# EAGLE design nvs_gps (EAGLE 6.4)
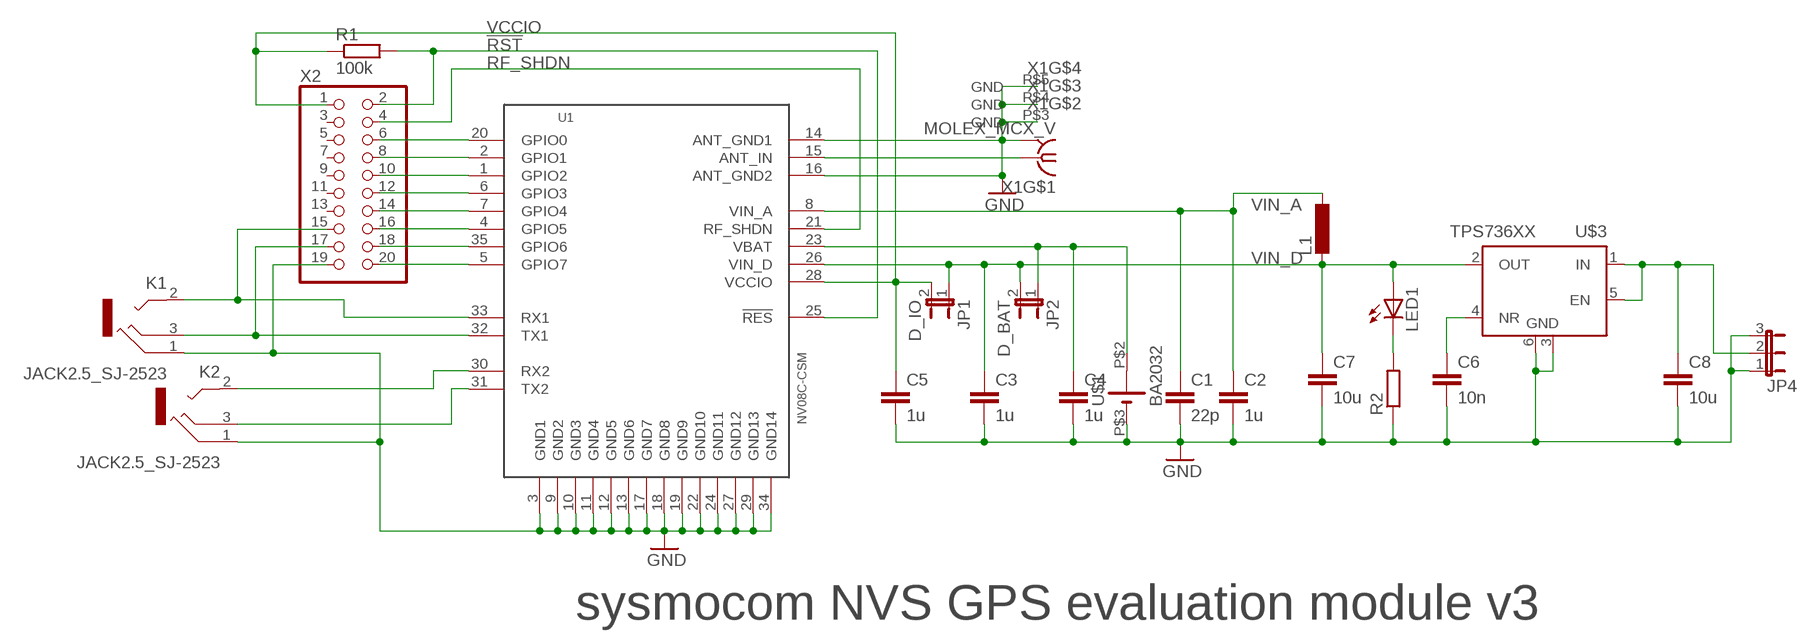
[diagram p0: schematic, sheet 1]

## Parts
C1  22p  C-EUC0402K  [C0402K]
C2  1u  C-EUC0603  [C0603]
C3  1u  C-EUC0603  [C0603]
C4  1u  C-EUC0603  [C0603]
C5  1u  C-EUC0603  [C0603]
C6  10n  C-EUC0603  [C0603]
C7  10u  C-EUC0603  [C0603]
C8  10u  C-EUC0603  [C0603]
JP1  D_IO  JP1E  [JP1]
JP2  D_BAT  JP1E  [JP1]
JP4  JP2E  [JP2]
K1  JACK2.5_SJ-2523  [JACK2.5_SJ-2523]
K2  JACK2.5_SJ-2523  [JACK2.5_SJ-2523]
L1  L-EU0603  [0603]
LED1  LED0603  [LED-0603]
R1  100k  R-EU_R0603  [R0603]
R2  R-EU_R0603  [R0603]
U1  NV08C-CSM  [NV08C-CSM]
U$1  BA2032  [BA2023-ND]
U$3  TPS736XX  [SOT223-6]
X1  MOLEX_MCX_V  [MOLEX_MCX_V]
X2  PINHD-2X10  [2X10]

## Nets
!RST: R1.2 U1.25(!RES) X2.2
GND [power]: C1.2 C2.2 C3.2 C4.2 C5.2 C6.2 C7.2 C8.2 JP4.1 JP4.3 K1.1(RING) K2.1(RING) R2.1 U1.3(GND1) U1.9(GND2) U1.10(GND3) U1.11(GND4) U1.12(GND5) U1.13(GND6) U1.14(ANT_GND1) U1.16(ANT_GND2) U1.17(GND7) U1.18(GND8) U1.19(GND9) U1.22(GND10) U1.24(GND11) U1.27(GND12) U1.29(GND13) U1.34(GND14) U$1.P$3(-) U$3.3(GND) U$3.6(GND1) X1.P$2(GND) X1.P$3(GND) X1.P$4(GND) X1.P$5(GND) X2.19
K1: K1.2(TIP) U1.33(RX1) X2.15
N$1: C6.1 U$3.4(NR)
N$2: U1.5(GPIO7) X2.20
N$3: U1.35(GPIO6) X2.18
N$4: K1.3(MIDDLE) U1.32(TX1) X2.17
N$5: K2.3(MIDDLE) U1.31(TX2)
N$6: K2.2(TIP) U1.30(RX2)
N$7 [power]: C4.1 JP2.1 U1.23(VBAT) U$1.P$2(+)
N$8: U1.4(GPIO5) X2.16
N$9: U1.7(GPIO4) X2.14
N$10: U1.6(GPIO3) X2.12
N$11: U1.1(GPIO2) X2.10
N$12: U1.2(GPIO1) X2.8
N$13: U1.20(GPIO0) X2.6
N$14: LED1.C R2.2
RF [rf]: U1.15(ANT_IN) X1.P$1
RF_SHDN: U1.21(RF_SHDN) X2.4
V_IN [power]: C8.1 JP4.2 U$3.1(IN) U$3.5(EN)
VCCIO [power]: C5.1 JP1.2 R1.1 U1.28(VCCIO) X2.1
VIN_A [power]: C1.1 C2.1 L1.1 U1.8(VIN_A)
VIN_D [power]: C3.1 C7.1 JP1.1 JP2.2 L1.2 LED1.A U1.26(VIN_D) U$3.2(OUT)
Unconnected: U$1.P$1(+) X2.3 X2.5 X2.7 X2.9 X2.11 X2.13

## Notes on the sheet
- sysmocom NVS GPS evaluation module v3

## Library data of the parts
C1-C8 = rcl:C-EU: CAPACITOR, European symbol
JP1 JP2 = jumper:JP1E: JUMPER
JP4 = jumper:JP2E: JUMPER
K1 K2 = laforge:JACK2.5_SJ-2523: CUI Inc. SJ-2523-SMT
L1 = laforge:L-EU0603
LED1 = SparkFun-LED:LED: LEDs Standard schematic elements and footprints for 5mm, 3mm, 1206, and 0603 sized LEDs. 5mm - Spark Fun Electronics SKU : COM-00529 (and others)
R1 R2 = rcl:R-EU_: RESISTOR, European symbol
U1 = laforge:NV08C-CSM
U$1 = laforge:BA2032
U$3 = laforge:TPS736XX: TI Cap-Free NMOS 400mA LDO
X1 = laforge:MOLEX_MCX_V: Molex 73366-0061 / Digi-Key WM5441-ND MCX straight vertical through-hold 50Ohms
X2 = pinhead:PINHD-2X10: PIN HEADER

## Net classes
0 default: width 0.254 mm, drill 0.254 mm
1 power: width 0.356 mm, drill 0.356 mm
2 rf: width 0.762 mm, clearance 0.152 mm

## Board
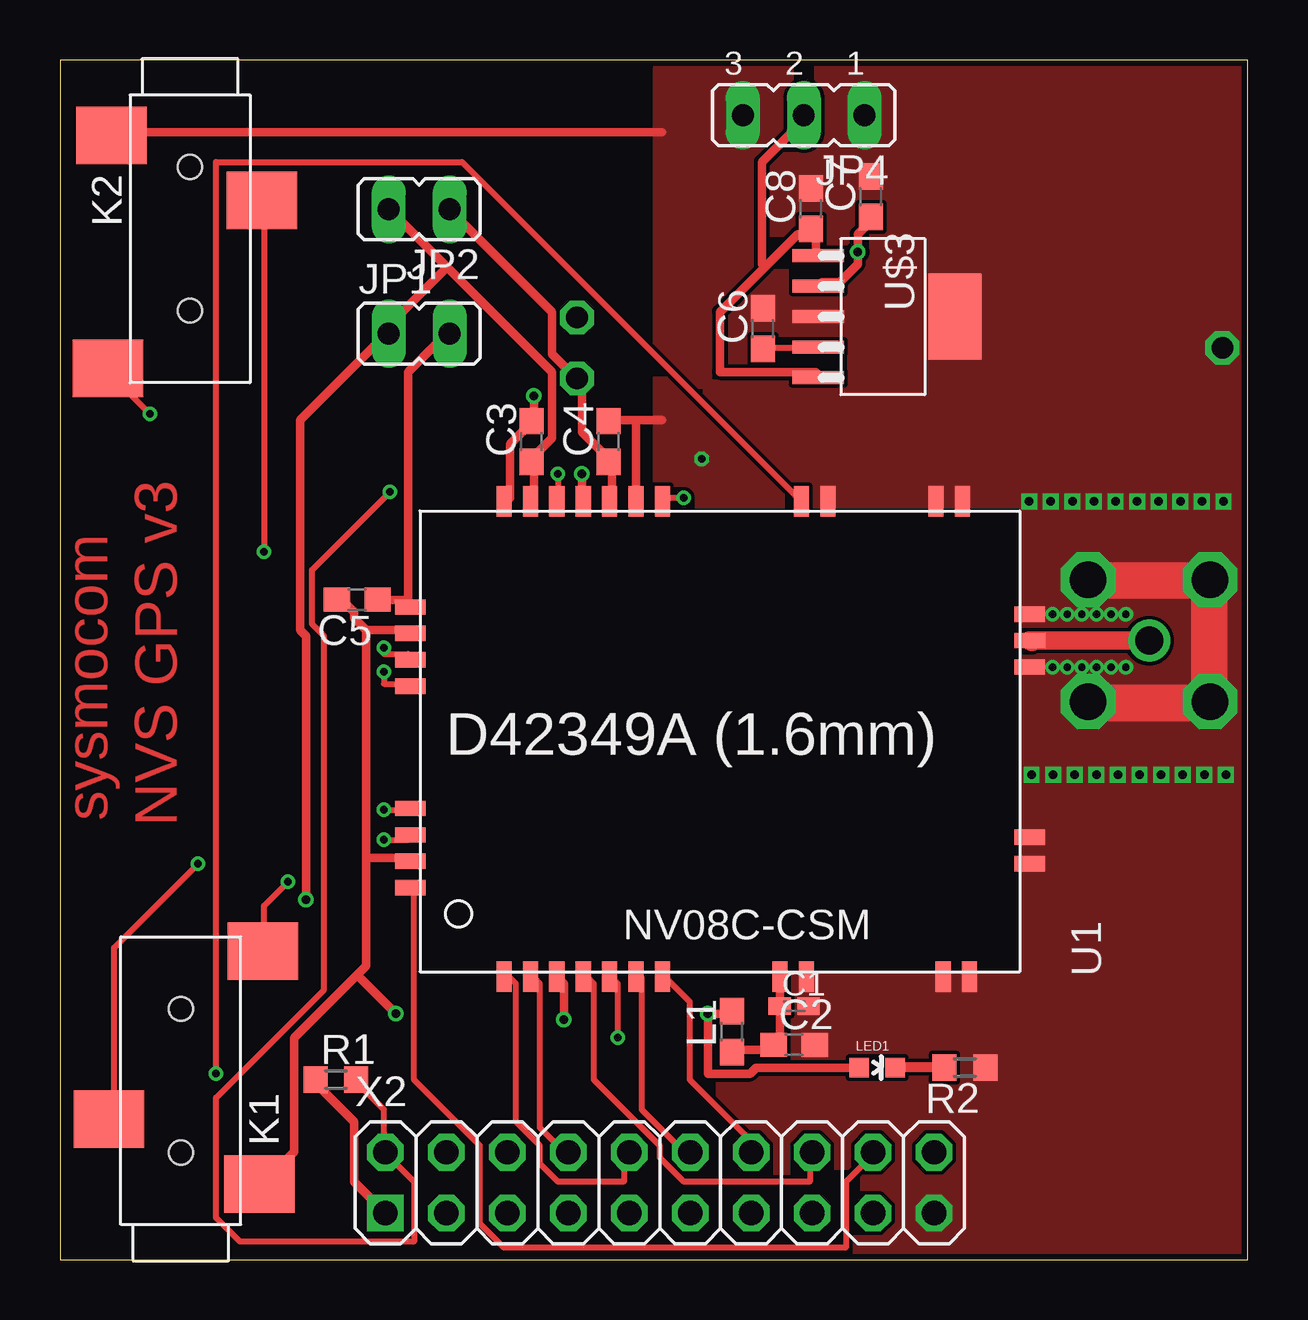
[diagram p1: board, top side]
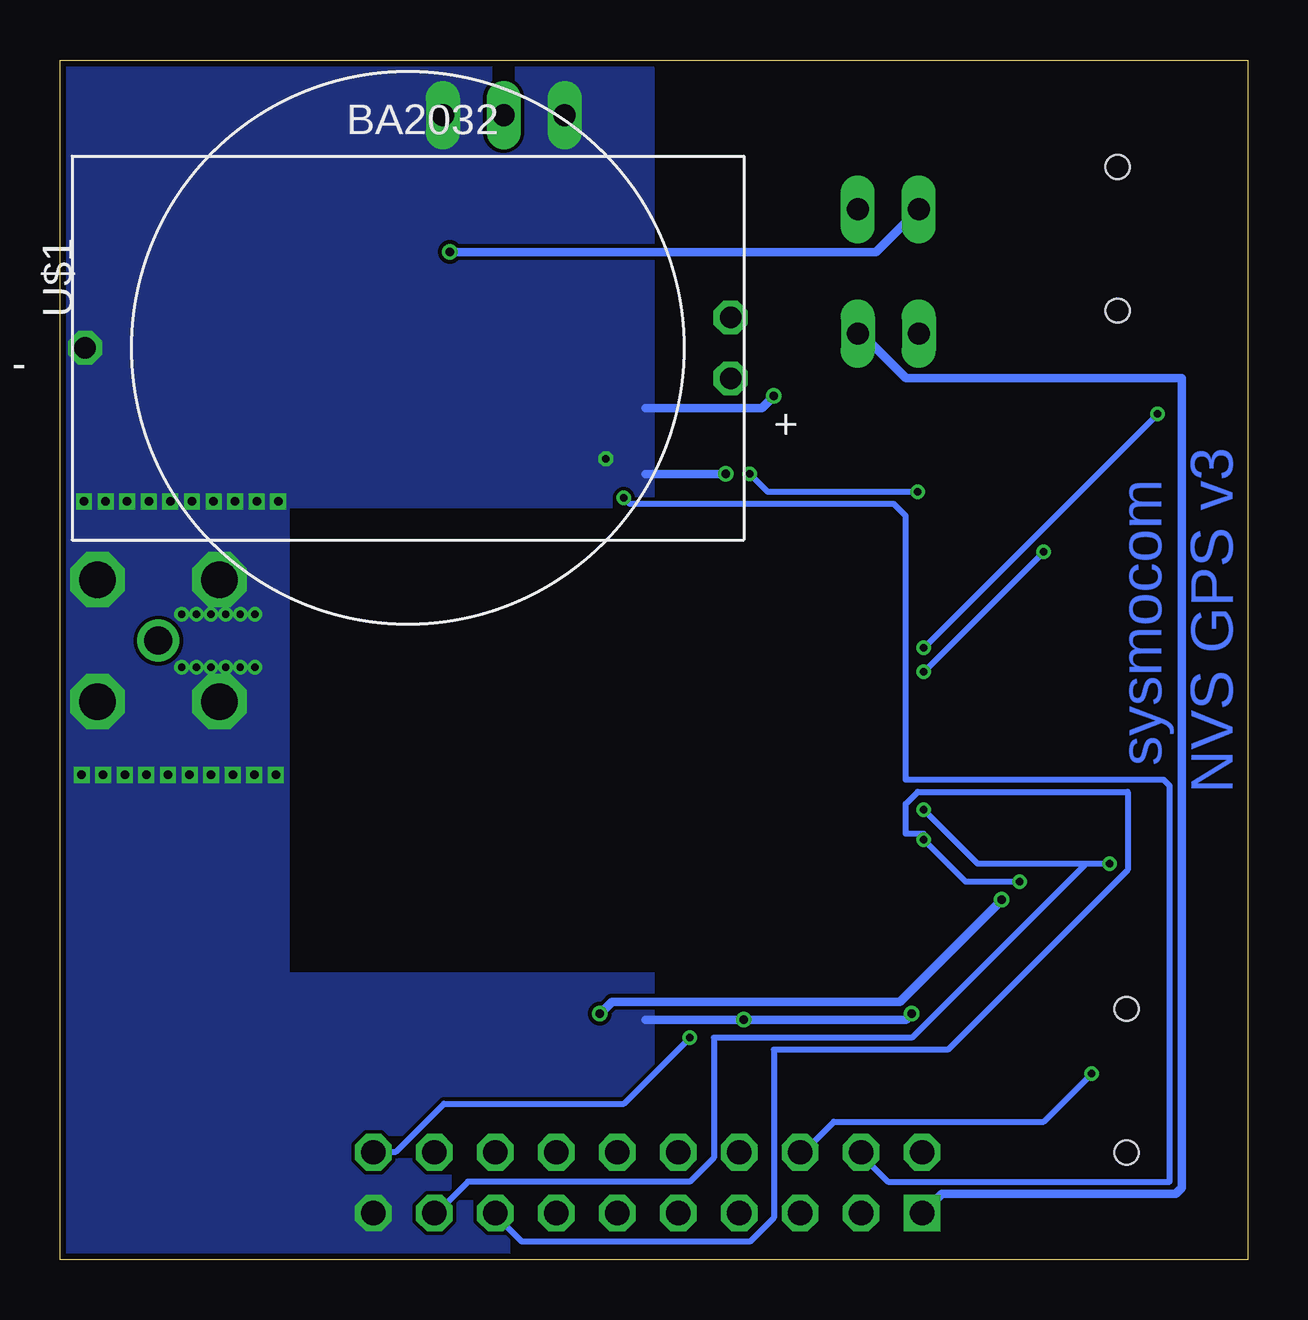
[diagram p2: board, bottom side, seen from below]

Size 49.5 x 50 mm. Coordinates in mm from the lower left corner, seen from the top.
Outline: 0,0 49.5,0 49.5,50 0,50 0,0
Copper layers (1*16): Top 0.035mm / dielectric 1.5mm / Bottom 0.035mm
Design rules "default": minimum track width 6mil, minimum drill 12mil, track to track 6mil, track to pad 6mil, pad to pad 6mil, via to via 6mil, smd to smd 0mil, copper to edge 10mil, drill to drill 10mil, minimum pad ring 10mil, minimum via ring 6mil, stop-mask expansion 2mil, vias tented up to drill 100mil, thermal gap 10mil

### Footprints (pad centres in the part's own frame; a part is rotated, then mirrored left to right if it is on the bottom)
C0402K = smd 0.925 x 0.74: 1 -0.6,0; 2 0.6,0
C0603 = smd 1.1 x 1: 1 -0.85,0; 2 0.85,0
JP1 = drill 0.914 long: 1 0,-1.27; 2 0,1.27
JP2 = drill 0.914 long: 1 -2.54,0; 2 0,0; 3 2.54,0
JACK2.5_SJ-2523 = smd 2.4 x 2.94: 1 -4.3,-3.274; 2 5.4,-3.424; 3 -1.6,3 | hole 1: -3,0; 3,0
0603 = smd 1.1 x 1: 1 -0.85,0; 2 0.85,0
LED-0603 = smd 0.8 x 0.8: A 0,-0.75; C 0,0.75
R0603 = smd 1 x 1.1: 1 -0.85,0; 2 0.85,0
NV08C-CSM = smd 0.635 x 1.27: 1 3.9,-19.8; 2 5,-19.8; 3 6.1,-19.8; 4 7.2,-19.8; 5 8.3,-19.8; 6 9.4,-19.8; 7 10.5,-19.8; 8 15.4,-19.8; 9 16.5,-19.8; 10 22.2,-19.8; 11 23.3,-19.8; 17 23,0; 18 21.9,0; 19 17.4,0; 20 16.3,0; 21 10.5,0; 22 9.4,0; 23 8.3,0; 24 7.2,0; 25 6.1,0; 26 5,0; 27 3.9,0 | smd 1.27 x 0.635: 12 25.8,-15.1; 13 25.8,-14; 14 25.8,-6.9; 15 25.8,-5.8; 16 25.8,-4.7; 28 0,-4.4; 29 0,-5.5; 30 0,-6.6; 31 0,-7.7; 32 0,-12.8; 33 0,-13.9; 34 0,-15; 35 0,-16.1
BA2023-ND = drill 0.9 octagon: P$1 13.45,1.27; P$2 13.45,-1.27; P$3 -13.45,0
SOT223-6 = smd 0.55 x 2.15: 1 -2.54,-2.7; 2 -1.27,-2.7; 3 0,-2.7; 4 1.27,-2.7; 5 2.54,-2.7 | smd 3.6 x 2.2: 6 0,3
MOLEX_MCX_V = drill 1.17: P$1 0,0 | drill 1.52 octagon: P$2 2.54,-2.54; P$3 2.54,2.54; P$4 -2.54,2.54; P$5 -2.54,-2.54
2X10 = drill 1.016 square: 1 -11.43,-1.27 | drill 1.016 octagon: 2 -11.43,1.27; 3 -8.89,-1.27; 4 -8.89,1.27; 5 -6.35,-1.27; 6 -6.35,1.27; 7 -3.81,-1.27; 8 -3.81,1.27; 9 -1.27,-1.27; 10 -1.27,1.27; 11 1.27,-1.27; 12 1.27,1.27; 13 3.81,-1.27; 14 3.81,1.27; 15 6.35,-1.27; 16 6.35,1.27; 17 8.89,-1.27; 18 8.89,1.27; 19 11.43,-1.27; 20 11.43,1.27

### Placement (x,y rotation side)
C1  30.6,10.56 0 top
C2  30.6,8.95 0 top
C3  19.66,34.1 90 top
C4  22.87,34.1 90 top
C5  12.39,27.5 180 top
C6  29.3,38.8 90 top
C7  33.8,44.3 90 top
C8  31.3,43.8 90 top
JP1  14.97,38.59 270 top
JP2  14.97,43.77 90 top
JP4  31,47.7 180 top
K1  5.04,7.45 90 top
K2  5.42,42.55 270 top
L1  28,9.5 90 top
LED1  34.06,8 270 top
R1  11.5,7.5 0 top
R2  37.72,8 180 top
U1  14.61,31.6 0 top
U$1  35,38 0 bottom
U$3  34.3,39.3 270 top
X1  45.4,25.8 0 top
X2  25,3.2 0 top

### Tracks (layer width: path | path; a pad name or v marks a point on that pad's centre or on a via)
!RST  (via drill 0.3)
  Top 0.254: R1.2 12.5,7.25 13.5,6.25 13.5,4.5 X2.2 13.75,4.25 14.75,3.25 14.75,0.75 7.5,0.75 6.5,1.75 6.5,6.75 11,11.25 11,26 10.5,26.5 10.5,28.75 v13.75,32 | v20.75,32.75 20.75,31.75 U1.25
  Bottom 0.254: v20.75,32.75 20,32 v13.75,32
GND  (via drill 0.3, 0.36)
  Top 0.356: 12.75,26.25 12.25,26.75 12.25,27 11.75,27.5 C5.2 | 12.75,26.25 14.5,26.25 U1.29 | 12.75,16.75 14.5,16.75 U1.34 | 12.75,26.25 12.75,16.75 | 12.38,11.88 12.75,12.25 12.75,16.75 | 12.38,11.88 9.75,9.25 9.75,4.5 8.5,3.25 K1.1 | U1.27 18.75,31.75 18.75,34 19.5,34.75 C3.2 19.75,35 v19.75,36 | 25.1,35 24,35 | 24,35 23,35 C4.2 | v21,10 21,11.5 20.75,11.75 U1.3 | v21.75,32.75 21.75,31.75 U1.24 | 24,35 24,31.75 U1.22 | 25.1,47 2.25,47 K2.1 | v14,10.25 12.38,11.88
  Top 1.524: 42.8,28.3 47.9,28.3 | 47.9,28.3 47.9,28.4 | 47.9,28.3 47.9,23.2 42.8,23.2 42.8,23.3
  Bottom 0.356: 25.1,10 v21,10 14.25,10 v14,10.25 | 25.1,32.75 v21.75,32.75 | v19.75,36 20.25,35.5 25.1,35.5
  other vias: 41.3,31.6 42.2,31.6 43.1,31.6 44,31.6 44.9,31.6 45.8,31.6 46.7,31.6 47.6,31.6 48.5,31.6 40.5,20.2 41.4,20.2 42.3,20.2 43.2,20.2 44.1,20.2 45,20.2 45.9,20.2 46.8,20.2 47.7,20.2 48.6,20.2 40.4,31.6 41.38,26.9 41.99,26.9 42.6,26.9 43.21,26.9 43.81,26.9 44.42,26.9 41.38,24.69 41.99,24.69 42.6,24.69 43.21,24.69 43.81,24.69 44.42,24.69 26.75,33.38
  pour Top (no thermals): 40.3,27 25.1,27 25.1,45.6 25.1,49.6 49,49.6 49,0.4 25,0.4 25,24.5 40.3,24.5 40.3,26.9
  pour Bottom (no thermals): 25.1,49.6 49.1,49.6 49.1,0.4 24.9,0.4 24.9,0.6 25.1,0.6
K1  (via drill 0.3)
  Top 0.254: v13.5,17.5 14.5,17.5 U1.33 | v9.5,15.75 8.5,14.75 8.5,13 K1.2
  Bottom 0.254: v9.5,15.75 11.75,15.75 v13.5,17.5 13.5,17.75 14.25,17.75 14.25,19 13.75,19.5 5,19.5 5,16.25 12.5,8.75 19.75,8.75 19.75,1.75 20.75,0.75 30.25,0.75 31.25,1.75 X2.15
N$1
  Top 0.254: C6.1 29.5,38 31.5,38 U$3.4
N$2  (via drill 0.3)
  Top 0.254: v23.25,9.25 23.25,11.5 23,11.75 U1.5
  Bottom 0.254: v23.25,9.25 26,6.5 33.5,6.5 35.5,4.5 36.25,4.5 X2.20
N$3
  Top 0.254: U1.35 14.75,15.25 14.75,7.5 17.5,4.75 17.5,1.5 18.5,0.5 32.75,0.5 32.75,3.25 33.75,4.25 X2.18
N$4  (via drill 0.3)
  Top 0.254: v13.5,18.75 14.5,18.75 U1.32 | v5.75,16.5 2.25,13 2.25,6 K1.3
  Bottom 0.254: v13.5,18.75 11.25,16.5 6.75,16.5 | v5.75,16.5 6.75,16.5 | 6.75,16.5 14,9.25 22.25,9.25 22.25,4.25 23.25,3.25 32.5,3.25 33.75,2 X2.17
N$5  (via drill 0.3)
  Top 0.254: v13.5,24.5 13.5,24 14.5,24 U1.31 | v8.5,29.5 8.5,44 K2.3
  Bottom 0.254: v8.5,29.5 v13.5,24.5
N$6  (via drill 0.3)
  Top 0.254: v13.5,25.5 13.5,25.25 14.5,25.25 U1.30 | v3.75,35.25 2,37 K2.2
  Bottom 0.254: v3.75,35.25 v13.5,25.5
N$7
  Top 0.356: U1.23 23,31.75 23,33 C4.1 22.75,33.5 21.75,34.5 21.75,36.5 U$1.P$2 21.5,36.75 20.5,37.75 20.5,39.5 16.25,43.75 JP2.1
N$8
  Top 0.254: U1.4 22,11.75 22.25,11.5 22.25,7.5 25,4.75 25,4.25 26,3.25 31.25,3.25 31.25,4.25 X2.16
N$9
  Top 0.254: U1.7 25.25,11.75 26.25,10.75 26.25,7.5 28.75,5 28.75,4.5 X2.14
N$10
  Top 0.254: U1.6 24.25,11.75 24.25,6.25 26.25,4.25 X2.12
N$11
  Top 0.254: U1.1 18.75,11.75 19,11.5 19,5.75 20,4.75 20,4 20.75,3.25 23.5,3.25 23.5,4.25 X2.10
N$12
  Top 0.254: U1.2 19.75,11.75 20,11.5 20,5.5 21,4.5 X2.8
N$13  (via drill 0.3)
  Top 0.254: v6.5,7.75 6.5,45.75 16.75,45.75 30.75,31.75 U1.20
  Bottom 0.254: v6.5,7.75 8.5,5.75 17.25,5.75 18.5,4.5 X2.6
N$14
  Top 0.406: R2.2 LED1.C
RF
  Top 0.762: U1.15 40.5,25.8 | 40.5,25.8 44.62,25.8 45,25.75 45.25,25.75 X1.P$1 | U1.15 40.5,25.75 40.5,25.8
RF_SHDN  (via drill 0.3)
  Top 0.254: v26,31.75 25.25,31.75 U1.21
  Bottom 0.254: v26,31.75 25.75,31.5 14.75,31.5 14.25,31 14.25,20 3.5,20 3.25,19.75 3.25,3.25 15,3.25 16,4.25 X2.4
V_IN
  Top 0.356: U$3.1 31.5,42 31.5,42.75 C8.1 31.25,42.75 30.75,42.75 29.38,41.38 | 29.38,41.38 27.5,39.5 27.5,37 31.5,37 U$3.5 | JP4.2 31,47.5 29.25,45.75 29.25,41.5 29.38,41.38
VCCIO
  Top 0.356: X2.1 12.25,3.25 12.25,5.75 10.75,7.25 R1.1 | 14.5,27.5 C5.1 | 14.5,27.5 14.5,27.25 U1.28 14.5,27.5 | 14.5,27.5 14.5,37 16,38.5 JP1.2
  Bottom 0.356: X2.1 12.75,2.75 3,2.75 2.75,3 2.75,36.75 14.25,36.75 16,38.5 JP1.2
VIN_A
  Top 0.356: U1.8 30,11.75 C1.1 30,9 C2.1 29.5,8.75 28.25,8.75 L1.1
VIN_D  (via drill 0.36)
  Top 0.356: C7.1 33.75,43.25 33.25,42.75 v33.25,42 33.25,41.5 32.5,40.75 31.75,40.75 U$3.2 | U1.26 19.75,31.75 19.75,33 C3.1 19.75,33.5 20.5,34.25 20.5,37 16.12,41.38 | 16.12,41.38 13.75,43.75 JP2.2 | v10.25,15 10.25,26 10,26.25 10,35 13.5,38.5 JP1.1 13.75,38.75 13.75,39 16.12,41.38 | L1.2 27.75,10.25 v27,10.25 27,7.75 28.75,7.75 29,8 33.25,8 LED1.A
  Bottom 0.356: v33.25,42 15.5,42 13.75,43.75 JP2.2 | v27,10.25 26.5,10.75 14.5,10.75 v10.25,15

### Text on the board
Top: sysmocom | NVS GPS v3
Bottom: sysmocom | NVS GPS v3
tPlace: D42349A (1.6mm)